# Altium project 4ADI_2DO.PrjPCB (part 2 of 6)
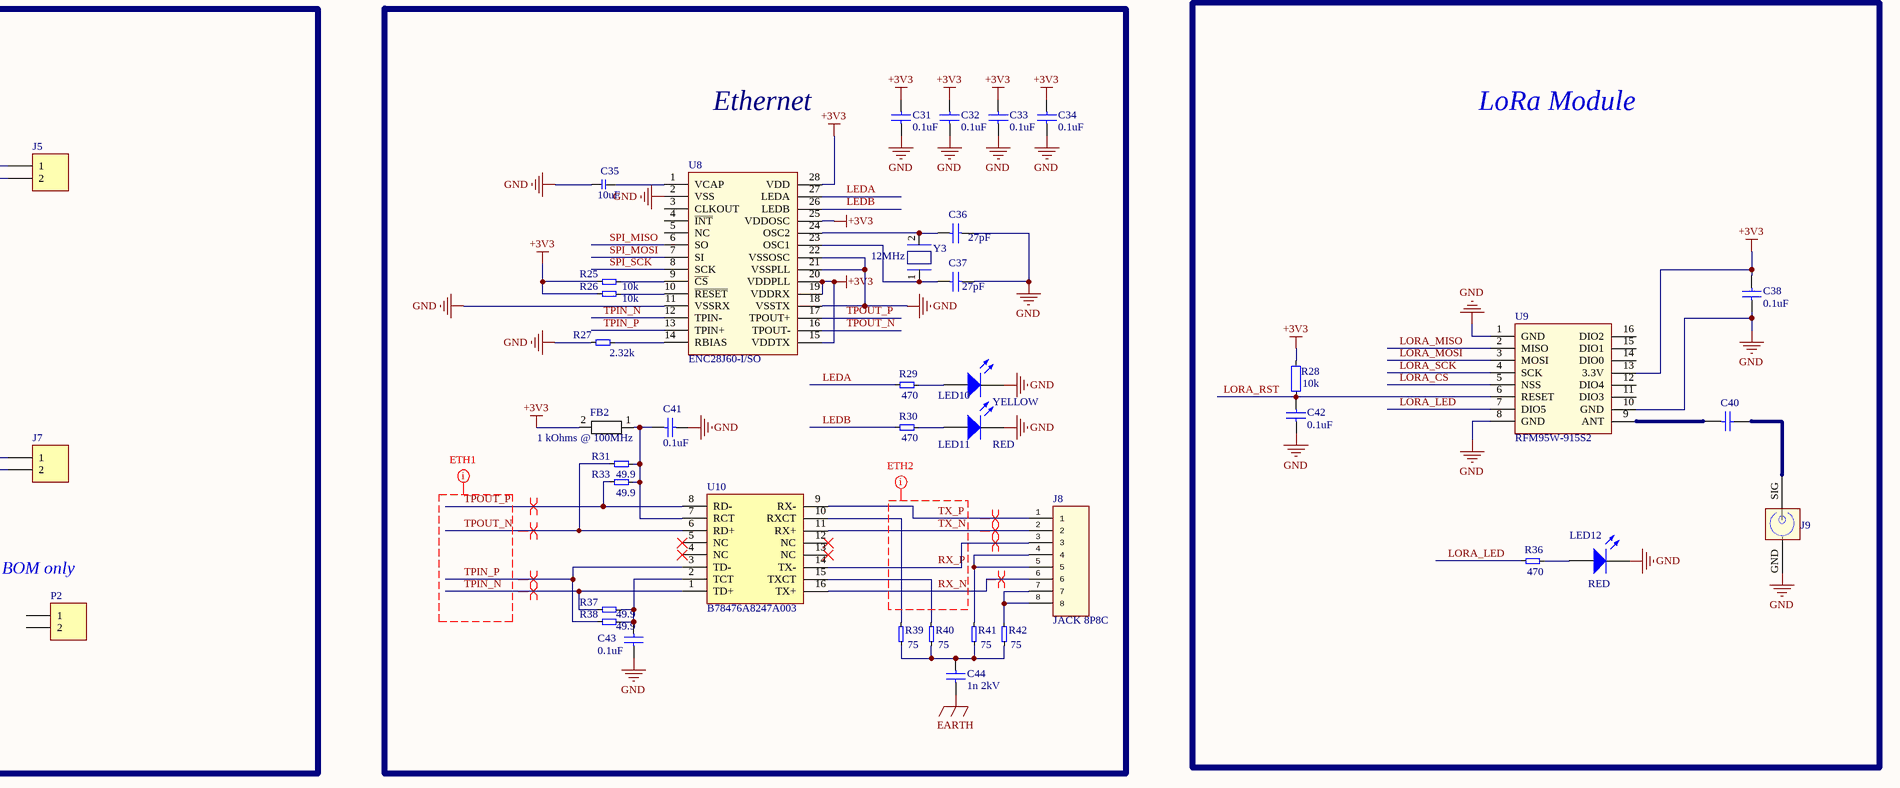
[diagram p8: main board.SchDoc, bottom right]

## Sheet main board.SchDoc (continued)
### Library data of the parts
BT1 = Battery: BATTERY LITHIUM 3V COIN 12.5MM; Manufacturer: Panasonic BSG; Capacity: 35mAh; Supplier 1: Digi-Key; Supplier Part Number 1: P279-ND; Manufacturer Part Number: CR-1220/FCN; Stock 1: 22607; Pricing 1: 1=1.28, 10=1.067, 50=0.9356, 100=0.8872, 250=0.82416, 500=0.78052, 1000=0.7369, 2500=0.68357 (USD); Mount: Through Hole; Contact Plating: Tin; Min Operating Temperature: -30°C; Max Operating Temperature: 60°C; Package Quantity: 1000; Output Voltage: 3V; Chemistry/Technology: Lithium; Voltage Rating: 3V; Packaging: Bulk; Termination: Through Hole; Orientation: Vertical; Diameter: 12mm; Height: 2mm; Lead Free: Lead Free; ComponentLink1URL: http://www.mouser.com/ds/2/315/AAA4000CE42-469979.pdf?src-supplier=Mouser; ComponentLink1Description: http://www.mouser.com/ds/2/315/AAA4000CE42-469979.pdf?src-supplier=Mouser; ComponentLink2URL: https://media.digikey.com/pdf/Data%20Sheets/Panasonic%20Inustrial/CR_Series.pdf?src-supplier=Digi-Key; ComponentLink2Description: https://media.digikey.com/pdf/Data%20Sheets/Panasonic%20Inustrial/CR_Series.pdf?src-supplier=Digi-Key
C1 C5 C9 C11 C13 C16 C19 C21 C22 C25-C34 C38 C41-C43 = Cap: CAP CER 0.1UF 50V X7R 0603; Manufacturer: Yageo; Manufacturer Part Number: CC0603KPX7R9BB104; Supplier 1: Digi-Key; Supplier Part Number 1: 311-3567-1-ND
C2 C14 C17 C18 C24 C35 C39 = CAP_0603: CAP CER 10UF 10V X5R 0603; Manufacturer: Murata; Manufacturer Part Number: GRM188R61A106KE69D; Tolerance: 10%; Supplier 1: Digi-Key; Supplier Part Number 1: 490-10474-1-ND; Stock 1: 6085579; Pricing 1: 1=0.21, 10=0.141, 100=0.0713, 500=0.04876, 1000=0.04313 (USD); Mount: Surface Mount; Case/Package: 0603; Case Code (Metric): 1608; Case Code (Imperial): 0603; Min Operating Temperature: -55°C; Max Operating Temperature: 85°C; Capacitance: 10uF; Packaging: Tape and Reel; Dielectric: X5R; Voltage Rating: 10V; Voltage: 10V; Voltage Rating (DC): 10V; Length: 1.6mm; Height: 0.8mm; Width: 0.031inch; Thickness: 0.037inch; Depth: 0.8mm; REACH SVHC: No SVHC; Lead Free: Lead Free
C3 C6 C36 C37 = Cap: CAP CER 27PF 50V C0G/NP0 0603; Manufacturer: Walsin Technologies; Manufacturer Part Number: 0603N270J500CT; Tolerance: 5%; Dielectric: C0G; Insulation Resistance: 10GR; Supplier 1: Digi-Key; Supplier Part Number 1: 1292-1511-1-ND; Stock 1: 158614; Pricing 1: 1=0.1, 10=0.033, 100=0.0149, 500=0.01062, 1000=0.00835 (USD); Case/Package: 0603; Case Code (Metric): 1608; Case Code (Imperial): 0603; Min Operating Temperature: -55°C; Max Operating Temperature: 125°C; Voltage Rating: 50V; Capacitance: 27pF; Packaging: Tape and Reel; Voltage Rating (DC): 50V; Length: 1.6mm; Depth: 0.8mm; Radiation Hardening: No; REACH SVHC: Unknown; Lead Free: Lead Free; ComponentLink1URL: https://www.verical.com/server-webapp/html/getDatasheet?partID=753102&src-supplier=Verical; ComponentLink1Description: https://www.verical.com/server-webapp/html/getDatasheet?partID=753102&src-supplier=Verical
C4 C15 = CAP_0805: CAP CER 22UF 10V X5R 0805; Manufacturer: Samsung; Manufacturer Part Number: CL21A226KPCLRNC; Tolerance: 10%; Supplier 1: Digi-Key; Supplier Part Number 1: 1276-6786-1-ND; Stock 1: 1160786; Pricing 1: 1=0.37, 10=0.255, 100=0.1443, 500=0.10186, 1000=0.08913 (USD); Mount: Surface Mount; Case/Package: 0805; Case Code (Metric): 2012; Case Code (Imperial): 0805; Min Operating Temperature: -55°C; Max Operating Temperature: 85°C; Packaging: Tape and Reel; Capacitance: 22uF; Dielectric: X5R; Voltage Rating: 10V; Length: 2mm; Width: 0.049inch; Thickness: 0.037inch; Depth: 1.25mm; Radiation Hardening: No; Lead Free: Lead Free; ComponentLink1URL: https://www.verical.com/server-webapp/html/getDatasheet?partID=781772&src-supplier=Verical; ComponentLink1Description: https://www.verical.com/server-webapp/html/getDatasheet?partID=781772&src-supplier=Verical
C7 C20 C23 = CAP_0603: CAP CER 2.2UF 10V X7R 0603; Manufacturer: Samsung; Manufacturer Part Number: CL10B225KP8NNNC; Material: Ceramic; Tolerance: 10%; Supplier 1: Digi-Key; Supplier Part Number 1: 1276-1134-1-ND; Stock 1: 529713; Pricing 1: 1=0.18, 10=0.128, 100=0.06, 500=0.0421, 1000=0.03485 (USD); Mount: Surface Mount; Case/Package: 0603; Case Code (Metric): 1608; Case Code (Imperial): 0603; Contact Plating: Tin; Min Operating Temperature: -55°C; Max Operating Temperature: 125°C; Package Quantity: 1; Packaging: Tape and Reel; Capacitance: 2.2uF; Voltage Rating: 10V; Dielectric: X7R; Length: 1.6mm; Height: 0.8mm; Width: 0.031inch; Thickness: 0.035inch; Depth: 0.8mm; Radiation Hardening: No; ComponentLink1URL: https://media.digikey.com/pdf/Data%20Sheets/Samsung%20PDFs/CL_Series_MLCC_ds.pdf?src-supplier=Digi-Key; ComponentLink1Description: https://media.digikey.com/pdf/Data%20Sheets/Samsung%20PDFs/CL_Series_MLCC_ds.pdf?src-supplier=Digi-Key; ComponentLink2URL: http://www1.futureelectronics.com/doc/SAMSUNG/CL10B225KP8NNNC.pdf?src-supplier=Future+Electronics; ComponentLink2Description: http://www1.futureelectronics.com/doc/SAMSUNG/CL10B225KP8NNNC.pdf?src-supplier=Future+Electronics; ComponentLink3URL: https://www.verical.com/server-webapp/html/getDatasheet?partID=359568&src-supplier=Verical; ComponentLink3Description: https://www.verical.com/server-webapp/html/getDatasheet?partID=359568&src-supplier=Verical; ComponentLink4URL: https://produktinfo.conrad.com/datenblaetter/450000-474999/457933-da-01-en-VS_KONDENSATOR_0603.pdf?src-supplier=Conrad; ComponentLink4Description: https://produktinfo.conrad.com/datenblaetter/450000-474999/457933-da-01-en-VS_KONDENSATOR_0603.pdf?src-supplier=Conrad
C8 C10 = Cap: CAP CER 15PF 50V C0G/NP0 0603; Manufacturer: Walsin Technologies; Manufacturer Part Number: 0603N150J500CT; Tolerance: 5%; Dielectric: C0G; Supplier 1: Digi-Key; Supplier Part Number 1: 1292-1487-1-ND; Stock 1: 223228; Pricing 1: 1=0.1, 10=0.033, 100=0.0149, 500=0.01062, 1000=0.00835 (USD); Case/Package: 0603; Case Code (Metric): 1608; Case Code (Imperial): 0603; Min Operating Temperature: -55°C; Max Operating Temperature: 125°C; Packaging: Tape and Reel; Capacitance: 15pF; Voltage Rating: 50V; Voltage Rating (DC): 50V; Length: 1.6mm; Depth: 0.8mm; REACH SVHC: Unknown
C12 = CAP_0402: Rating: 50V; Value: NF; Supplier 1: Digi-Key
C40 = CAP: CAP CER 10PF 50V NPO 0603; Manufacturer: Yageo; Manufacturer Part Number: AC0603JRNPO9BN100; ComponentLink1URL: https://www.verical.com/server-webapp/html/getDatasheet?partID=355281&src-supplier=Verical; ComponentLink1Description: https://www.verical.com/server-webapp/html/getDatasheet?partID=355281&src-supplier=Verical; ComponentLink2URL: http://www.samsungsem.com/kr/support/product-search/mlcc/CL05C100JB5NNNC.jsp?src-supplier=Digi-Key; ComponentLink2Description: http://www.samsungsem.com/kr/support/product-search/mlcc/CL05C100JB5NNNC.jsp?src-supplier=Digi-Key; ComponentLink3URL: http://www1.futureelectronics.com/doc/SAMSUNG/CL05C100JB5NNNC.pdf?src-supplier=Future+Electronics; ComponentLink3Description: http://www1.futureelectronics.com/doc/SAMSUNG/CL05C100JB5NNNC.pdf?src-supplier=Future+Electronics; ComponentLink4URL: https://produktinfo.conrad.com/datenblaetter/450000-474999/458733-da-01-en-VS_KONDENSATOR_0402.pdf?src-supplier=Conrad; ComponentLink4Description: https://produktinfo.conrad.com/datenblaetter/450000-474999/458733-da-01-en-VS_KONDENSATOR_0402.pdf?src-supplier=Conrad; Supplier 1: Digi-Key; Supplier Part Number 1: 311-3088-1-ND
C44 = Cap: CAP CER 1000PF 2KV X7R 1210; Manufacturer: Kyocera AVX; Manufacturer Part Number: 1210GC102MAT1A; Capacitance: 1nF; Tolerance: 20%; Dissipation Factor: 2.5%; ComponentLink1URL: http://www.farnell.com/datasheets/1818074.pdf?src-supplier=Element14; ComponentLink1Description: http://www.farnell.com/datasheets/1818074.pdf?src-supplier=Element14; ComponentLink2URL: http://catalogs.avx.com/SurfaceMount.pdf?src-supplier=Digi-Key; ComponentLink2Description: http://catalogs.avx.com/SurfaceMount.pdf?src-supplier=Digi-Key; ComponentLink3URL: http://www.farnell.com/datasheets/1679506.pdf?src-supplier=Element14; ComponentLink3Description: http://www.farnell.com/datasheets/1679506.pdf?src-supplier=Element14; Supplier 1: Digi-Key; Supplier Part Number 1: 478-5184-1-ND; Stock 1: 16002; Pricing 1: 1=1.03, 10=0.781, 100=0.5588, 500=0.43264, 1000=0.37254 (USD); Mount: Surface Mount; Case/Package: 1210; Number of Pins: 2; Case Code (Metric): 3225; Case Code (Imperial): 1210; Contact Plating: Tin,Matte; Min Operating Temperature: -55°C; Max Operating Temperature: 125°C; Package Quantity: 2000; Voltage Rating: 2kV; Packaging: Tape and Reel; Voltage Rating (DC): 2kV; Dielectric: X7R; Termination: SMD/SMT; Length: 3.2mm; Height: 1.7mm; Width: 0.098inch; Thickness: 0.067inch; Depth: 2.5mm; Radiation Hardening: No; REACH SVHC: No SVHC; Lead Free: Lead Free; ComponentLink4URL: http://datasheets.avx.com/AVX-HV_MLCC.pdf?src-supplier=Digi-Key; ComponentLink4Description: http://datasheets.avx.com/AVX-HV_MLCC.pdf?src-supplier=Digi-Key; ComponentLink5URL: http://www.avx.com/docs/Catalogs/aphvc.pdf?src-supplier=Future+Electronics; ComponentLink5Description: http://www.avx.com/docs/Catalogs/aphvc.pdf?src-supplier=Future+Electronics; ComponentLink6URL: http://www.mouser.com/ds/2/40/X7RDielectric-777024.pdf?src-supplier=Mouser; ComponentLink6Description: http://www.mouser.com/ds/2/40/X7RDielectric-777024.pdf?src-supplier=Mouser
D1-D3 D6-D8 = DF2B7AFS,L3M: BIDIRECTIONAL ESD DIODE VRWM=+/-; Manufacturer: Toshiba; Manufacturer Part Number: DF2B7AFU,H3F; Supplier 1: Digi-Key; Supplier Part Number 1: DF2B7AFUH3FCT-ND
D4 D9 D10 = DIODE_1N4148X-TP: DIODE GEN PURP 75V 150MA SOD523; Manufacturer: MCC; Max Surge Current: 2A; Recovery Time: 4ns; Forward Voltage: 1.25V; Forward Current: 300mA; Max Reverse Leakage Current: 1uA; Power Dissipation: 200mW; Max Repetitive Reverse Voltage (Vrrm): 100V; Element Configuration: Single; Polarity: Standard; Capacitance: 2pF; Supplier 1: Digi-Key; Supplier Part Number 1: 1N4148XTPMSCT-ND; Manufacturer Part Number: 1N4148X-TP; Stock 1: 2140400; Pricing 1: 1=0.14, 10=0.125, 100=0.0815, 500=0.03986, 1000=0.02718 (USD); Mount: Surface Mount; Number of Pins: 2; Min Operating Temperature: -65°C; Max Operating Temperature: 150°C; Package Quantity: 1; Packaging: Tape and Reel; Average Rectified Current: 150mA; Reverse Recovery Time: 4ns; Peak Non-Repetitive Surge Current: 2A; Voltage Rating (DC): 75V; Current Rating: 150mA; Output Current: 300mA; Max Reverse Voltage (DC): 75V; Radiation Hardening: No; Lead Free: Lead Free; ComponentLink1URL: http://www.mccsemi.com/up_pdf/1N4148X(SOD-523).PDF?src-supplier=Digi-Key; ComponentLink1Description: http://www.mccsemi.com/up_pdf/1N4148X(SOD-523).PDF?src-supplier=Digi-Key; ComponentLink2URL: http://www.mouser.com/ds/2/258/1N4148X(SOD-523)-349105.pdf?src-supplier=Mouser; ComponentLink2Description: http://www.mouser.com/ds/2/258/1N4148X(SOD-523)-349105.pdf?src-supplier=Mouser; ComponentLink3URL: http://www.mccsemi.com/up_pdf/1N4148X(SOD-523).PDF?src-supplier=Future+Electronics; ComponentLink3Description: http://www.mccsemi.com/up_pdf/1N4148X(SOD-523).PDF?src-supplier=Future+Electronics
D5 = PMEG2020EJF: DIODE SCHOTTKY 20V 2A SC90; Manufacturer: Nexperia; Supplier 1: Digi-Key; Supplier Part Number 1: 1727-7474-1-ND; Manufacturer Part Number: PMEG2020EJF; Stock 1: 34040; Pricing 1: 1=0.41, 10=0.336, 100=0.2287, 500=0.17156, 1000=0.12866 (USD)
FB1 FB2 = Ferrite bead: FERRITE BEAD 1 KOHM 0603 1LN; Manufacturer: Wurth Electronics; Manufacturer Part Number: 74279266; Tolerance: 25%; Impedance: 1kR; Current Rating: 200mA; DC Resistance (DCR): 600mR; Inductance: 1.8nH; Shielding: Unshielded; Supplier 1: Digi-Key; Supplier Part Number 1: 732-4484-1-ND; Stock 1: 104717; Pricing 1: 1=0.17, 50=0.168, 100=0.155, 500=0.148, 1000=0.141, 2000=0.134 (USD); Case/Package: SMD/SMT; Case Code (Metric): 1608; Case Code (Imperial): 0603; Core Material: Ferrite; Min Operating Temperature: -55°C; Max Operating Temperature: 125°C; Packaging: Tape and Reel; Max DC Current: 200mA; Termination: SMD/SMT; Test Frequency: 100MHz; Length: 1.6mm; Height: 0.8mm; Depth: 0.8mm; Width: 0.8mm; REACH SVHC: Unknown; Lead Free: Lead Free; ComponentLink1URL: http://docs-europe.electrocomponents.com/webdocs/1408/0900766b8140888f.pdf?src-supplier=Allied+Electronics; ComponentLink1Description: http://docs-europe.electrocomponents.com/webdocs/1408/0900766b8140888f.pdf?src-supplier=Allied+Electronics; ComponentLink2URL: http://documents.rs-components.com/techlib://itc_doclist_GB.htm?stockno=3674856&src-supplier=RSComponents; ComponentLink2Description: http://documents.rs-components.com/techlib://itc_doclist_GB.htm?stockno=3674856&src-supplier=RSComponents; ComponentLink3URL: https://katalog.we-online.de/pbs/datasheet/74279266.pdf?src-supplier=Digi-Key; ComponentLink3Description: https://katalog.we-online.de/pbs/datasheet/74279266.pdf?src-supplier=Digi-Key; ComponentLink4URL: http://www.farnell.com/datasheets/1920067.pdf?src-supplier=Element14; ComponentLink4Description: http://www.farnell.com/datasheets/1920067.pdf?src-supplier=Element14; ComponentLink5URL: http://www.mouser.com/ds/2/445/74279266-221135.pdf?src-supplier=Mouser; ComponentLink5Description: http://www.mouser.com/ds/2/445/74279266-221135.pdf?src-supplier=Mouser; ComponentLink6URL: http://www.produktinfo.conrad.com/datenblaetter/1000000-1099999/001087059-da-01-ml-WE_CBF_SMD_FERRIT_74279266_de_en.pdf?src-supplier=Conrad; ComponentLink6Description: http://www.produktinfo.conrad.com/datenblaetter/1000000-1099999/001087059-da-01-ml-WE_CBF_SMD_FERRIT_74279266_de_en.pdf?src-supplier=Conrad
J1 J3 = 10118194-0001LF: CONN RCPT USB2.0 MICRO B SMD R/A; Manufacturer: Amphenol FCI; Gender: Receptacle; Current Rating: 1.8A; Connector Type: USB,Receptacle; Number of Contacts: 5; Insulation Resistance: 1GR; Number of Ports: 1; Max Voltage Rating (AC): 100V; Pitch: 0.65mm; Supplier 1: Digi-Key; Supplier Part Number 1: 609-4618-1-ND; Manufacturer Part Number: 10118194-0001LF; Stock 1: 145984; Pricing 1: 1=0.42, 10=0.393, 25=0.3536, 50=0.3144, 100=0.3013, 250=0.27512, 500=0.26202 (USD); Mount: Surface Mount,Horizontal; Contact Material: Copper Alloy; Contact Plating: Gold; Number of Terminals: 5; Housing Material: Polymer; Color: Black; Min Operating Temperature: -55°C; Max Operating Temperature: 85°C; Package Quantity: 9600; Packaging: Tape and Reel; Termination: Solder; Orientation: Right Angle; Features: Shielded; Length: 8.05mm; Depth: 5mm; Radiation Hardening: No; Lead Free: Lead Free; Flammability Rating: UL94 V-0; ComponentLink1URL: http://www.amphenol-icc.com/media/wysiwyg/files/drawing/10118194.pdf?src-supplier=Digi-Key; ComponentLink1Description: http://www.amphenol-icc.com/media/wysiwyg/files/drawing/10118194.pdf?src-supplier=Digi-Key; ComponentLink2URL: https://cdn.amphenol-icc.com/media/wysiwyg/files/drawing/10118194.pdf?src-supplier=Mouser; ComponentLink2Description: https://cdn.amphenol-icc.com/media/wysiwyg/files/drawing/10118194.pdf?src-supplier=Mouser; ComponentLink3URL: https://cdn.amphenol-icc.com/media/wysiwyg/files/drawing/10118194.pdf?src-supplier=Avnet; ComponentLink3Description: https://cdn.amphenol-icc.com/media/wysiwyg/files/drawing/10118194.pdf?src-supplier=Avnet; ComponentLink4URL: https://cdn.amphenol-icc.com/media/wysiwyg/files/drawing/10118194.pdf?src-supplier=Verical; ComponentLink4Description: https://cdn.amphenol-icc.com/media/wysiwyg/files/drawing/10118194.pdf?src-supplier=Verical
J2 = FTSH-105-01-F-DV-K: CONN HEADER SMD 10POS 1.27MM; Manufacturer: Samtec; Manufacturer Part Number: FTSH-105-01-F-DV-K-TR; Max Current Rating: 1.75A; Number of Contacts: 10; Supplier 1: Digi-Key; Supplier Part Number 1: SAM13160CT-ND; Stock 1: 1946; Pricing 1: 1=3.36, 10=3.221, 100=2.684 (USD); Contact Plating: Gold; Contact Material: Bronze; Housing Color: Black; Housing Material: Polymer; Min Operating Temperature: -55°C; Max Operating Temperature: 125°C; Number of Rows: 2; Packaging: Tape and Reel; Termination: Solder; Orientation: Straight; Length: 6.35mm; Pitch: 1.27mm; Depth: 3.43mm; Radiation Hardening: No; Lead Free: Lead Free; ComponentLink1URL: http://www.samtec.com/documents/webfiles/pdf/ftsh_mt.pdf?src-supplier=Avnet+Europe; ComponentLink1Description: http://www.samtec.com/documents/webfiles/pdf/ftsh_mt.pdf?src-supplier=Avnet+Europe; ComponentLink2URL: http://www.samtec.com/documents/webfiles/pdf/ftsh_mt.pdf?src-supplier=Avnet; ComponentLink2Description: http://www.samtec.com/documents/webfiles/pdf/ftsh_mt.pdf?src-supplier=Avnet; ComponentLink3URL: https://www.verical.com/server-webapp/html/getDatasheet?partID=314617&src-supplier=Verical; ComponentLink3Description: https://www.verical.com/server-webapp/html/getDatasheet?partID=314617&src-supplier=Verical
J4 J6 = Header 4: Header, 4-Pin; Manufacturer: Amphenol FCI; Manufacturer Part Number: 68001-404HLF; Current Rating: 3A; Voltage Rating: 1.5kV; Number of Positions: 4; Insulation Resistance: 5GR; Gender: Male; Connector Type: Male Pin; Pitch: 2.54mm; Mating Post Length: 5.84mm; LatestRevisionDate: 17-Jul-2002; LatestRevisionNote: Re-released for DXP Platform.; Publisher: Altium Limited; Supplier 1: Digi-Key; Supplier Part Number 1: 609-3404-ND; Stock 1: 0; Mount: Through Hole; Contact Plating: Tin; Contact Material: Bronze; Color: Black; Housing Color: Black; Housing Material: Thermoplastic; Min Operating Temperature: -65°C; Max Operating Temperature: 125°C; Number of Rows: 1; Contact Gender: Male; Packaging: Bulk; Package Quantity: 100; Termination: Solder; Number of Contacts: 4; Max Voltage Rating (AC): 1.5kV; Orientation: Straight; Length: 10.16mm; Termination Post Length: 3.05mm; Contact Mating Length: 0.23inch; Depth: 2.41mm; Radiation Hardening: No; Lead Free: Lead Free; Flammability Rating: UL94 V-0; ComponentLink1URL: http://www.mouser.com/ds/2/154/68000-50221.pdf; ComponentLink1Description: http://www.mouser.com/ds/2/154/68000-50221.pdf; ComponentLink2URL: http://portal.fciconnect.com/Comergent/fci/drawing/68000.pdf; ComponentLink2Description: http://portal.fciconnect.com/Comergent/fci/drawing/68000.pdf; ComponentLink3URL: https://cdn.amphenol-icc.com/media/wysiwyg/files/drawing/68000.pdf; ComponentLink3Description: https://cdn.amphenol-icc.com/media/wysiwyg/files/drawing/68000.pdf
J5 J7 = Header 2: TERM BLK 2P SIDE ENT 5.08MM PCB; Manufacturer: Sauro; Manufacturer Part Number: CIM025P5; Supplier 1: Digi-Key
J8 = RJ45 SMD CONNECTOR: CONN MOD JACK 8P8C R/A SHIELDED; Manufacturer: Molex; Manufacturer Part Number: 95622-3981; Connector Type: RJ45; Number of Ports: 1; Number of Positions Loaded: 8; Current Rating: 1.5A; Gender: Female; Voltage Rating: 125V; Pitch: 2.54mm; ComponentLink1URL: https://www.verical.com/server-webapp/html/getDatasheet?partID=757801&src-supplier=Verical; ComponentLink1Description: https://www.verical.com/server-webapp/html/getDatasheet?partID=757801&src-supplier=Verical; ComponentLink2URL: http://www.molex.com/webdocs/datasheets/pdf/en-us/0956223981_MODULAR_JACKS_PLUG.pdf?src-supplier=Avnet; ComponentLink2Description: http://www.molex.com/webdocs/datasheets/pdf/en-us/0956223981_MODULAR_JACKS_PLUG.pdf?src-supplier=Avnet; ComponentLink3URL: http://www.onlinecomponents.com/productFiles/mf-MOL/28460956223981_modular_jacks_plug.pdf?src-supplier=Onlinecomponents.com; ComponentLink3Description: http://www.onlinecomponents.com/productFiles/mf-MOL/28460956223981_modular_jacks_plug.pdf?src-supplier=Onlinecomponents.com; Supplier 1: Digi-Key; Supplier Part Number 1: WM3653-ND; Stock 1: 7934; Pricing 1: 1=1.74, 10=1.575, 25=1.4784, 50=1.4142, 100=1.35, 250=1.2214, 500=1.12498, 1000=0.96428, 2500=0.89999 (USD); Mount: Through Hole; Contact Plating: Gold; Contact Material: Brass,Copper; Housing Color: Black; Housing Material: Polymer; Color: Black; Min Operating Temperature: -40°C; Max Operating Temperature: 80°C; Package Quantity: 1848; Shielding: Shielded; Packaging: Rail/Tube; Termination: Through Hole; Orientation: Right Angle; Number of Positions: 8; Number of Contacts: 8; Length: 15.6mm; Depth: 18.8mm; Radiation Hardening: No; REACH SVHC: Unknown; Halogen Free: Low Halogen; Flammability Rating: UL94 V-0
J9 = U.FL-R-SMT(10): CONN U.FL RCPT STR 50 OHM SM; Manufacturer: Hirose; Body Material: Bronze; Plating: Silver; Dielectric Material: Polymer; Impedance: 50R; Connector Type: Coaxial,Receptacle,Male Pin; Max Frequency: 6GHz; Supplier 1: Digi-Key; Supplier Part Number 1: H9161CT-ND; Manufacturer Part Number: U.FL-R-SMT(10); Stock 1: 217446; Pricing 1: 1=1.31, 10=1.15, 25=1.0824, 50=1.0374, 100=0.9922, 250=0.902, 500=0.8118, 1000=0.7216 (USD); Mount: Surface Mount; Case/Package: SMD/SMT; Contact Material: Brass; Contact Plating: Gold; Body Plating: Silver; Housing Color: Beige; Min Operating Temperature: -40°C; Max Operating Temperature: 90°C; Package Quantity: 1; Fastening Type: Snap; Packaging: Tape and Reel; Termination: Solder; Frequency: 6GHz; Orientation: Vertical; Length: 3mm; Depth: 3.1mm; Radiation Hardening: No; Lead Free: Lead Free; ComponentLink1URL: https://www.verical.com/server-webapp/html/getDatasheet?partID=449682&src-supplier=Verical; ComponentLink1Description: https://www.verical.com/server-webapp/html/getDatasheet?partID=449682&src-supplier=Verical
K1 K2 = 5V RELAY: RELAY GENERAL PURPOSE SPDT 8A 5V; Manufacturer: Omron; Manufacturer Part Number: G6RN-1-DC5; Voltage Rating (AC): 250V; Voltage Rating (DC): 30V; Coil Current: 44mA; Coil Resistance: 114R; Operate Time: 15ms; Power Consumption: 220mW; Coil Type: Non-Latching; Release Time: 5ms; Approvals: UL,CSA,VDE,IEC; Supplier 1: Digi-Key; Supplier Part Number 1: Z987-ND; Stock 1: 11252; Pricing 1: 1=3.2, 10=3.003, 25=2.6696, 50=2.5362, 100=2.4028, 250=2.1358, 500=2.00232, 1000=1.86883, 5000=1.80209 (USD); Mount: Through Hole,PCB; Number of Pins: 5; Weight: 9g; Contact Material: Silver,Gold; Min Operating Temperature: -40°C; Max Operating Temperature: 85°C; Contact Current Rating: 8A; Max Current Rating: 8A; Max Voltage Rating (AC): 250V; Max Voltage Rating (DC): 30V; Packaging: Bulk; Throw Configuration: SPDT; Termination: PC Pin; Coil Voltage (DC): 5V; Package Quantity: 400; Relay Type: General Purpose; Coil Power: 220mW; Current Rating: 8A; Length: 28.5mm; Height: 15.3mm; Depth: 10mm; Radiation Hardening: No; Lead Free: Lead Free; ComponentLink1URL: https://www.verical.com/server-webapp/html/getDatasheet?partID=761854&src-supplier=Verical; ComponentLink1Description: https://www.verical.com/server-webapp/html/getDatasheet?partID=761854&src-supplier=Verical
LED1-LED4 LED6 LED8 LED9 LED11 LED12 = LED_0402: LED RED CLEAR 2SMD; Manufacturer: Everlight Electronics Co Ltd; Manufacturer Part Number: 19-217/R6C-AL1M2VY/3T; Supplier 1: Digi-Key; Supplier Part Number 1: 1080-1585-1-ND
LED5 LED7 LED10 = LED_0402: LED YELLOW CLEAR CHIP SMD; Manufacturer: Lite-On Inc.; Manufacturer Part Number: LTST-C193KSKT-5A; Supplier 1: Digi-Key; Supplier Part Number 1: 160-1831-1-ND
P1 P2 = Header 2: Plug; Manufacturer: Sauro; Manufacturer Part Number: CIF02005; Supplier 1: Digi-Key
Q1-Q3 = MMBT2222LT1G: TRANS NPN 30V 0.6A SOT23; Manufacturer: ON Semiconductor; hFE Min: 100; Frequency: 250MHz; Max Power Dissipation: 225mW; Number of Elements: 1; Max Collector Current: 600mA; Collector Base Voltage (VCBO): 60V; Emitter Base Voltage (VEBO): 5V; Collector Emitter Saturation Voltage: 1.6V; Power Dissipation: 300mW; Element Configuration: Single; Supplier 1: Digi-Key; Supplier Part Number 1: MMBT2222LT1GOSCT-ND; Manufacturer Part Number: MMBT2222LT1G; Stock 1: 167907; Pricing 1: 1=0.14, 10=0.129, 100=0.0703, 500=0.04328, 1000=0.02952 (USD); Case/Package: SOT-23-3; Number of Pins: 3; Weight: 0.01lb; Contact Plating: Tin,Matte; Min Operating Temperature: -55°C; Max Operating Temperature: 150°C; Collector Emitter Voltage (VCEO): 30V; Package Quantity: 1; Packaging: Tape and Reel; Transition Frequency: 250MHz; Collector Emitter Breakdown Voltage: 30V; Max Breakdown Voltage: 30V; Polarity: NPN; Max Frequency: 250MHz; Termination: SMD/SMT; Gain Bandwidth Product: 250MHz; Voltage Rating (DC): 30V; Current Rating: 600mA; Length: 3.04mm; Height: 1.11mm; Width: 2.64mm; Radiation Hardening: No; REACH SVHC: No SVHC; Lead Free: Lead Free; ComponentLink1URL: http://www.onsemi.com/pub/Collateral/MMBT2222LT1-D.PDF?src-supplier=Digi-Key; ComponentLink1Description: http://www.onsemi.com/pub/Collateral/MMBT2222LT1-D.PDF?src-supplier=Digi-Key; ComponentLink2URL: https://www.verical.com/server-webapp/html/getDatasheet?partID=91924&src-supplier=Verical; ComponentLink2Description: https://www.verical.com/server-webapp/html/getDatasheet?partID=91924&src-supplier=Verical; ComponentLink3URL: http://www.onsemi.com/pub/Collateral/MMBT2222LT1-D.PDF?src-supplier=Element14; ComponentLink3Description: http://www.onsemi.com/pub/Collateral/MMBT2222LT1-D.PDF?src-supplier=Element14; ComponentLink4URL: http://www.onsemi.com/pub/Collateral/MMBT2222LT1-D.PDF?src-supplier=Avnet+Europe; ComponentLink4Description: http://www.onsemi.com/pub/Collateral/MMBT2222LT1-D.PDF?src-supplier=Avnet+Europe; ComponentLink5URL: http://www.farnell.com/datasheets/1644026.pdf?src-supplier=Element14; ComponentLink5Description: http://www.farnell.com/datasheets/1644026.pdf?src-supplier=Element14; ComponentLink6URL: http://www.mouser.com/ds/2/308/MMBT2222LT1-D-80103.pdf?src-supplier=Mouser; ComponentLink6Description: http://www.mouser.com/ds/2/308/MMBT2222LT1-D-80103.pdf?src-supplier=Mouser; ComponentLink7URL: http://www.onsemi.com/pub_link/Collateral/MMBT2222LT1-D.PDF?src-supplier=Future+Electronics; ComponentLink7Description: http://www.onsemi.com/pub_link/Collateral/MMBT2222LT1-D.PDF?src-supplier=Future+Electronics; ComponentLink8URL: http://www.onsemi.com/pub/Collateral/MMBT2222LT1-D.PDF?src-supplier=Avnet; ComponentLink8Description: http://www.onsemi.com/pub/Collateral/MMBT2222LT1-D.PDF?src-supplier=Avnet
Q4 Q5 = 2N3904: TRANS NPN 40V 0.2A TO-92; Manufacturer: ON Semiconductor / Fairchild; Max Power Dissipation: 625mW; Number of Elements: 1; hFE Min: 100; Frequency: 300MHz; Max Collector Current: 200mA; Collector Base Voltage (VCBO): 60V; Emitter Base Voltage (VEBO): 6V; Collector Emitter Saturation Voltage: 300mV; Element Configuration: Single; Supplier 1: Digi-Key; Supplier Part Number 1: 2N3904FS-ND; Manufacturer Part Number: 2N3904BU; Stock 1: 110507; Pricing 1: 1=0.21, 10=0.173, 100=0.0916, 500=0.06024, 1000=0.04097 (USD); Mount: Through Hole; Case/Package: TO-92; Number of Pins: 3; Weight: 0.179g; Min Operating Temperature: -55°C; Max Operating Temperature: 150°C; Package Quantity: 1000; Collector Emitter Voltage (VCEO): 40V; Packaging: Bulk; Transition Frequency: 300MHz; Polarity: NPN; Collector Emitter Breakdown Voltage: 40V; Power Dissipation: 625mW; Max Frequency: 300MHz; Gain Bandwidth Product: 300MHz; Voltage Rating (DC): 60V; Current Rating: 200mA; Length: 5.2mm; Height: 5.33mm; Width: 4.19mm; Radiation Hardening: No; REACH SVHC: No SVHC; Lead Free: Lead Free; ComponentLink1URL: http://www.farnell.com/datasheets/2110847.pdf?src-supplier=Farnell; ComponentLink1Description: http://www.farnell.com/datasheets/2110847.pdf?src-supplier=Farnell; ComponentLink2URL: https://www.fairchildsemi.com/datasheets/MM/MMBT3904.pdf?src-supplier=Digi-Key; ComponentLink2Description: https://www.fairchildsemi.com/datasheets/MM/MMBT3904.pdf?src-supplier=Digi-Key; ComponentLink3URL: http://www.fairchildsemi.com/ds/MM/MMBT3904.pdf?src-supplier=Avnet+Europe; ComponentLink3Description: http://www.fairchildsemi.com/ds/MM/MMBT3904.pdf?src-supplier=Avnet+Europe; ComponentLink4URL: http://www.jameco.com/Jameco/Products/ProdDS/783421.pdf?src-supplier=Jameco; ComponentLink4Description: http://www.jameco.com/Jameco/Products/ProdDS/783421.pdf?src-supplier=Jameco; ComponentLink5URL: https://www.verical.com/server-webapp/html/getDatasheet?partID=185752&src-supplier=Verical; ComponentLink5Description: https://www.verical.com/server-webapp/html/getDatasheet?partID=185752&src-supplier=Verical
R1 R2 R5-R8 R12 R29 R30 R36 = R_0402: RES SMD 470 OHM 1% 1/10W 0603; Manufacturer: Yageo; Manufacturer Part Number: RC0603FR-07470RL; Supplier 1: Digi-Key; Supplier Part Number 1: 311-470HRCT-ND
R3 = Res_0603: RES SMD 4.7K OHM 1% 1/10W 0603; Manufacturer: Yageo Phycomp; Manufacturer Part Number: RC0603FR-074K7L; Temperature Coefficient: 100ppm/°C; Voltage Rating (DC): 50V; Resistance: 4.7kR; Power Rating: 100mW; Supplier 1: Digi-Key; Supplier Part Number 1: 311-4.70KHRCT-ND; Stock 1: 19144100; Pricing 1: 1=0.1, 10=0.024, 100=0.0097, 1000=0.00437, 2500=0.00379 (USD); Mount: Surface Mount; Case/Package: 0603; Number of Pins: 2; Min Operating Temperature: -55°C; Max Operating Temperature: 155°C; Tolerance: 1%; Packaging: Cut Tape; Length: 1.6mm; Height: 0.45mm; Width: 800um; Depth: 0.8mm; REACH SVHC: No SVHC; Lead Free: Lead Free
R4 R9 R13 R14 R16 R17 = R_0402: RES SMD 0 OHM JUMPER 1/10W 0603; Manufacturer: Yageo; Manufacturer Part Number: RC0603JR-070RL; ComponentLink1URL: http://www.yageo.com/documents/recent/PYu-RC_Group_51_RoHS_L_10.pdf?src-supplier=Digi-Key; ComponentLink1Description: http://www.yageo.com/documents/recent/PYu-RC_Group_51_RoHS_L_10.pdf?src-supplier=Digi-Key; ComponentLink2URL: http://www.yageo.com/documents/recent/PYu-RC0402_51_RoHS_L_6.pdf?src-supplier=Avnet+Europe; ComponentLink2Description: http://www.yageo.com/documents/recent/PYu-RC0402_51_RoHS_L_6.pdf?src-supplier=Avnet+Europe; ComponentLink3URL: http://www.farnell.com/datasheets/1018594.pdf?src-supplier=Element14; ComponentLink3Description: http://www.farnell.com/datasheets/1018594.pdf?src-supplier=Element14; ComponentLink4URL: https://www.verical.com/server-webapp/html/getDatasheet?partID=326379&src-supplier=Verical; ComponentLink4Description: https://www.verical.com/server-webapp/html/getDatasheet?partID=326379&src-supplier=Verical; ComponentLink5URL: http://www.farnell.com/datasheets/2167052.pdf?src-supplier=Element14; ComponentLink5Description: http://www.farnell.com/datasheets/2167052.pdf?src-supplier=Element14; Supplier 1: Digi-Key; Supplier Part Number 1: 311-0.0GRCT-ND
R10 R18 = R_0402: RES SMD 100K OHM 1% 1/10W 0603; Manufacturer: Yageo; Manufacturer Part Number: RC0603FR-07100KL; Resistance: 100kR; Temperature Coefficient: 100ppm/°C; Voltage Rating (DC): 50V; Power Rating: 100mW; Working Voltage: 75V; ComponentLink1URL: http://www.yageo.com/documents/recent/PYu-RC_Group_51_RoHS_L_10.pdf?src-supplier=Digi-Key; ComponentLink1Description: http://www.yageo.com/documents/recent/PYu-RC_Group_51_RoHS_L_10.pdf?src-supplier=Digi-Key; ComponentLink2URL: http://www.farnell.com/datasheets/1018594.pdf?src-supplier=Element14; ComponentLink2Description: http://www.farnell.com/datasheets/1018594.pdf?src-supplier=Element14; ComponentLink3URL: http://www.yageo.com/documents/recent/PYu-RC_Group_51_RoHS_L_9.pdf?src-supplier=Verical; ComponentLink3Description: http://www.yageo.com/documents/recent/PYu-RC_Group_51_RoHS_L_9.pdf?src-supplier=Verical; ComponentLink4URL: http://www.yageo.com/documents/recent/PYu-RC_Group_51_RoHS_L_8.pdf?src-supplier=Future+Electronics; ComponentLink4Description: http://www.yageo.com/documents/recent/PYu-RC_Group_51_RoHS_L_8.pdf?src-supplier=Future+Electronics; ComponentLink5URL: http://www.yageo.com/documents/recent/PYu-RC_Group_51_RoHS_L_9.pdf?src-supplier=Mouser; ComponentLink5Description: http://www.yageo.com/documents/recent/PYu-RC_Group_51_RoHS_L_9.pdf?src-supplier=Mouser; ComponentLink6URL: http://documents.rs-components.com/techlib://itc_doclist_GB.htm?stockno=6185797&src-supplier=RSComponents; ComponentLink6Description: http://documents.rs-components.com/techlib://itc_doclist_GB.htm?stockno=6185797&src-supplier=RSComponents; ComponentLink7URL: http://www.farnell.com/datasheets/2167052.pdf?src-supplier=Element14; ComponentLink7Description: http://www.farnell.com/datasheets/2167052.pdf?src-supplier=Element14; ComponentLink8URL: http://www.farnell.com/datasheets/1868787.pdf?src-supplier=Element14; ComponentLink8Description: http://www.farnell.com/datasheets/1868787.pdf?src-supplier=Element14; ComponentLink9URL: http://documents.rs-components.com/techlib://itc_doclist_GB.htm?stockno=5048940&src-supplier=RSComponents; ComponentLink9Description: http://documents.rs-components.com/techlib://itc_doclist_GB.htm?stockno=5048940&src-supplier=RSComponents; ComponentLink10URL: http://www.farnell.com/datasheets/443971.pdf?src-supplier=Element14; ComponentLink10Description: http://www.farnell.com/datasheets/443971.pdf?src-supplier=Element14; Supplier 1: Digi-Key; Supplier Part Number 1: 311-100KHRCT-ND; Stock 1: 44881179; Pricing 1: 1=0.1, 10=0.023, 100=0.0094, 1000=0.00421, 2500=0.00366 (USD); Case/Package: 0603; Number of Pins: 2; Case Code (Imperial): 0603; Case Code (Metric): 1608; Min Operating Temperature: -55°C; Max Operating Temperature: 155°C; Tolerance: 1%; Packaging: Tape and Reel; Composition: Thick Film; Military Standard: Not; Voltage Rating: 50V; Termination: SMD/SMT; Number of Terminations: 2; Length: 1.6mm; Height: 0.45mm; Width: 0.8mm; Depth: 0.8mm; REACH SVHC: No SVHC; Lead Free: Lead Free
R11 = R_0402: Tolerance: 1%; Value: NF; Supplier 1: Digi-Key
R15 R19-R21 R24-R26 R35 = R_0402: RES SMD 10K OHM 1% 1/10W 0603; Manufacturer: Yageo; Manufacturer Part Number: RC0603FR-0710KL; ComponentLink1URL: http://www.farnell.com/datasheets/2167052.pdf?src-supplier=Element14; ComponentLink1Description: http://www.farnell.com/datasheets/2167052.pdf?src-supplier=Element14; ComponentLink2URL: http://www.farnell.com/datasheets/1784430.pdf?src-supplier=Element14; ComponentLink2Description: http://www.farnell.com/datasheets/1784430.pdf?src-supplier=Element14; ComponentLink3URL: http://documents.rs-components.com/techlib://itc_doclist_GB.htm?stockno=6185832&src-supplier=RSComponents; ComponentLink3Description: http://documents.rs-components.com/techlib://itc_doclist_GB.htm?stockno=6185832&src-supplier=RSComponents; ComponentLink4URL: http://www.yageo.com/documents/recent/PYu-RC0402_51_RoHS_L_6_r.pdf?src-supplier=Future+Electronics; ComponentLink4Description: http://www.yageo.com/documents/recent/PYu-RC0402_51_RoHS_L_6_r.pdf?src-supplier=Future+Electronics; ComponentLink5URL: http://www.farnell.com/datasheets/1686128.pdf?src-supplier=Element14; ComponentLink5Description: http://www.farnell.com/datasheets/1686128.pdf?src-supplier=Element14; ComponentLink6URL: http://www.farnell.com/datasheets/1018594.pdf?src-supplier=Element14; ComponentLink6Description: http://www.farnell.com/datasheets/1018594.pdf?src-supplier=Element14; ComponentLink7URL: http://www.yageo.com/documents/recent/PYu-RC_Group_51_RoHS_L_9.pdf?src-supplier=Mouser; ComponentLink7Description: http://www.yageo.com/documents/recent/PYu-RC_Group_51_RoHS_L_9.pdf?src-supplier=Mouser; Supplier 1: Digi-Key; Supplier Part Number 1: 311-10.0KHRCT-ND
R22 R23 R32 R34 = R_0402: RES SMD 1K OHM 1% 1/10W 0603; Manufacturer: Yageo; Manufacturer Part Number: RC0603FR-071KL; ComponentLink1URL: http://documents.rs-components.com/techlib://itc_doclist_GB.htm?stockno=6186122&src-supplier=RSComponents; ComponentLink1Description: http://documents.rs-components.com/techlib://itc_doclist_GB.htm?stockno=6186122&src-supplier=RSComponents; ComponentLink2URL: http://www.mouser.com/ds/2/447/PYu-RC0402_51_RoHS_L_6_r-8721.pdf?src-supplier=Mouser; ComponentLink2Description: http://www.mouser.com/ds/2/447/PYu-RC0402_51_RoHS_L_6_r-8721.pdf?src-supplier=Mouser; ComponentLink3URL: http://www.yageo.com/documents/recent/PYu-RC0402_51_RoHS_L_6_r.pdf?src-supplier=Future+Electronics; ComponentLink3Description: http://www.yageo.com/documents/recent/PYu-RC0402_51_RoHS_L_6_r.pdf?src-supplier=Future+Electronics; ComponentLink4URL: http://www.farnell.com/datasheets/1018594.pdf?src-supplier=Element14; ComponentLink4Description: http://www.farnell.com/datasheets/1018594.pdf?src-supplier=Element14; ComponentLink5URL: http://www.farnell.com/datasheets/2167052.pdf?src-supplier=Element14; ComponentLink5Description: http://www.farnell.com/datasheets/2167052.pdf?src-supplier=Element14; Supplier 1: Digi-Key; Supplier Part Number 1: 311-1.00KHRCT-ND
R27 = R_0402: RES SMD 2.32K OHM 1% 1/10W 0603; Manufacturer: Yageo; Manufacturer Part Number: RC0603FR-072K32L; Resistance: 2.32kR; Power Rating: 100mW; Voltage Rating: 50V; Temperature Coefficient: 100ppm/°C; ComponentLink1URL: http://www.yageo.com/documents/recent/PYu-RC0402_51_RoHS_L_6.pdf?src-supplier=Avnet; ComponentLink1Description: http://www.yageo.com/documents/recent/PYu-RC0402_51_RoHS_L_6.pdf?src-supplier=Avnet; ComponentLink2URL: http://www.mouser.com/ds/2/447/PYu-RC0402_51_RoHS_L_6_r-8721.pdf?src-supplier=Mouser; ComponentLink2Description: http://www.mouser.com/ds/2/447/PYu-RC0402_51_RoHS_L_6_r-8721.pdf?src-supplier=Mouser; ComponentLink3URL: http://www.yageo.com/documents/recent/PYu-RC0402_51_RoHS_L_6.pdf?src-supplier=Avnet+Europe; ComponentLink3Description: http://www.yageo.com/documents/recent/PYu-RC0402_51_RoHS_L_6.pdf?src-supplier=Avnet+Europe; Supplier 1: Digi-Key; Supplier Part Number 1: 311-2.32KHRCT-ND; Stock 1: 582075; Pricing 1: 1=0.1, 10=0.023, 100=0.0094, 1000=0.00421, 2500=0.00366 (USD); Case/Package: 0603; Case Code (Metric): 1608; Case Code (Imperial): 0603; Min Operating Temperature: -55°C; Max Operating Temperature: 155°C; Package Quantity: 1; Tolerance: 1%; Packaging: Tape and Reel; Composition: Thick Film; Number of Terminations: 2; Termination: SMD/SMT; Military Standard: Not; Max Power Dissipation: 100mW; Voltage Rating (DC): 50V; Features: Moisture Resistant; Length: 1.6mm; Height: 0.022inch; Width: 0.031inch; Depth: 0.8mm; Lead Free: Lead Free; ComponentLink4URL: http://www.yageo.com/documents/recent/PYu-RC_Group_51_RoHS_L_10.pdf?src-supplier=Digi-Key; ComponentLink4Description: http://www.yageo.com/documents/recent/PYu-RC_Group_51_RoHS_L_10.pdf?src-supplier=Digi-Key; ComponentLink5URL: http://www.yageo.com/documents/recent/PYu-RC_Group_51_RoHS_L_9.pdf?src-supplier=Digi-Key; ComponentLink5Description: http://www.yageo.com/documents/recent/PYu-RC_Group_51_RoHS_L_9.pdf?src-supplier=Digi-Key; ComponentLink6URL: http://www.mouser.com/catalog/specsheets/RC0603.pdf?src-supplier=Mouser; ComponentLink6Description: http://www.mouser.com/catalog/specsheets/RC0603.pdf?src-supplier=Mouser
R28 = Res_0603: RES SMD 10K OHM 1% 1/10W 0603; Manufacturer: Yageo; Manufacturer Part Number: RC0603FR-0710KL; Resistance: 10kR; Temperature Coefficient: 100ppm/°C; Voltage Rating (DC): 50V; Power Rating: 100mW; Supplier 1: Digi-Key; Supplier Part Number 1: 311-10.0KHRCT-ND; Stock 1: 97048265; Pricing 1: 1=0.1, 10=0.024, 100=0.0097, 1000=0.00437, 2500=0.00379 (USD); Mount: Surface Mount; Case/Package: 0603; Number of Pins: 2; Min Operating Temperature: -55°C; Max Operating Temperature: 155°C; Packaging: Tape and Reel; Tolerance: 1%; Composition: Thick Film; Military Standard: Not; Length: 1.6mm; Height: 0.45mm; Width: 800um; Depth: 0.8mm; REACH SVHC: No SVHC; Lead Free: Lead Free; ComponentLink1URL: https://www.verical.com/server-webapp/html/getDatasheet?partID=409289&src-supplier=Verical; ComponentLink1Description: https://www.verical.com/server-webapp/html/getDatasheet?partID=409289&src-supplier=Verical
R31 R33 R37 R38 = R_0402: RES SMD 49.9 OHM 1% 1/10W 0603; Manufacturer: Yageo; Manufacturer Part Number: RC0603FR-0749R9L; Resistance: 49.9R; Power Rating: 100mW; Temperature Coefficient: 100ppm/°C; Voltage Rating (DC): 50V; ComponentLink1URL: http://documents.rs-components.com/techlib://itc_doclist_GB.htm?stockno=6184536&src-supplier=RSComponents; ComponentLink1Description: http://documents.rs-components.com/techlib://itc_doclist_GB.htm?stockno=6184536&src-supplier=RSComponents; ComponentLink2URL: http://www.farnell.com/datasheets/2167052.pdf?src-supplier=Element14; ComponentLink2Description: http://www.farnell.com/datasheets/2167052.pdf?src-supplier=Element14; ComponentLink3URL: http://www.yageo.com/documents/recent/PYu-RC0402_51_RoHS_L_6_r.pdf?src-supplier=Future+Electronics; ComponentLink3Description: http://www.yageo.com/documents/recent/PYu-RC0402_51_RoHS_L_6_r.pdf?src-supplier=Future+Electronics; ComponentLink4URL: http://www.farnell.com/datasheets/1018594.pdf?src-supplier=Element14; ComponentLink4Description: http://www.farnell.com/datasheets/1018594.pdf?src-supplier=Element14; ComponentLink5URL: http://www.yageo.com/documents/recent/PYu-RC_Group_51_RoHS_L_10.pdf?src-supplier=Digi-Key; ComponentLink5Description: http://www.yageo.com/documents/recent/PYu-RC_Group_51_RoHS_L_10.pdf?src-supplier=Digi-Key; Supplier 1: Digi-Key; Supplier Part Number 1: 311-49.9HRCT-ND; Stock 1: 9614882; Pricing 1: 1=0.1, 10=0.023, 100=0.0094, 1000=0.00421, 2500=0.00366 (USD); Case/Package: 0603; Number of Pins: 2; Case Code (Imperial): 0603; Case Code (Metric): 1608; Min Operating Temperature: -55°C; Max Operating Temperature: 155°C; Packaging: Tape and Reel; Tolerance: 1%; Military Standard: Not; Composition: Thick Film; Voltage Rating: 50V; Termination: SMD/SMT; Length: 1.6mm; Height: 0.45mm; Depth: 0.8mm; Lead Free: Lead Free; REACH SVHC: No SVHC; ComponentLink6URL: https://www.verical.com/server-webapp/html/getDatasheet?partID=325421&src-supplier=Verical; ComponentLink6Description: https://www.verical.com/server-webapp/html/getDatasheet?partID=325421&src-supplier=Verical; ComponentLink7URL: http://documents.rs-components.com/techlib://itc_doclist_GB.htm?stockno=5047565&src-supplier=RSComponents; ComponentLink7Description: http://documents.rs-components.com/techlib://itc_doclist_GB.htm?stockno=5047565&src-supplier=RSComponents
R39-R42 = R_0402: RES SMD 75 OHM 1% 1/10W 0603; Manufacturer: Yageo; Manufacturer Part Number: RC0603FR-0775RL; Resistance: 75R; Power Rating: 100mW; Voltage Rating: 50V; Temperature Coefficient: 100ppm/°C; Supplier 1: Digi-Key; Supplier Part Number 1: 311-75.0HRCT-ND; Stock 1: 9632228; Pricing 1: 1=0.1, 10=0.023, 100=0.0094, 1000=0.00421, 2500=0.00366 (USD); Case/Package: 0603; Case Code (Metric): 1608; Case Code (Imperial): 0603; Min Operating Temperature: -55°C; Max Operating Temperature: 155°C; Tolerance: 1%; Package Quantity: 1; Packaging: Tape and Reel; Composition: Thick Film; Number of Terminations: 2; Termination: SMD/SMT; Max Power Dissipation: 100mW; Voltage Rating (DC): 50V; Features: Moisture Resistant; Military Standard: Not; Length: 0.063inch; Height: 0.022inch; Width: 0.031inch; Depth: 0.8mm; Lead Free: Lead Free; REACH SVHC: No SVHC; ComponentLink1URL: http://www.yageo.com/documents/recent/PYu-RC_Group_51_RoHS_L_10.pdf?src-supplier=Digi-Key; ComponentLink1Description: http://www.yageo.com/documents/recent/PYu-RC_Group_51_RoHS_L_10.pdf?src-supplier=Digi-Key; ComponentLink2URL: http://www.farnell.com/datasheets/2167052.pdf?src-supplier=Element14; ComponentLink2Description: http://www.farnell.com/datasheets/2167052.pdf?src-supplier=Element14; ComponentLink3URL: http://documents.rs-components.com/techlib://itc_doclist_GB.htm?stockno=5048417&src-supplier=RSComponents; ComponentLink3Description: http://documents.rs-components.com/techlib://itc_doclist_GB.htm?stockno=5048417&src-supplier=RSComponents
SW1 = 219-3LPSTR: SWITCH SLIDE DIP SPST 100MA 20V; Manufacturer: CTS; Number of Positions: 3; Electrical Life: 2000Cycles; Actuator Type: Slide (Standard); Pitch: 0.1inch; Washable: Yes; Supplier 1: Digi-Key; Supplier Part Number 1: CT3115CT-ND; Manufacturer Part Number: 219-3LPSTR; Stock 1: 17768; Pricing 1: 1=0.82, 10=0.804, 25=0.758, 50=0.7116, 100=0.6806, 250=0.64964, 500=0.58776 (USD); Mount: Surface Mount; Contact Material: Copper; Contact Plating: Gold; Min Operating Temperature: -55°C; Max Operating Temperature: 85°C; Max Current Rating: 100mA; Packaging: Tape and Reel; Throw Configuration: SPST; Voltage Rating (DC): 20V; Package Quantity: 1000; Current Rating: 100mA; Termination: Gull Wing; Max Voltage Rating (DC): 20V; Orientation: Straight; Length: 0.358inch; Depth: 9.91mm; Radiation Hardening: No; Lead Free: Lead Free; ComponentLink1URL: https://www.verical.com/server-webapp/html/getDatasheet?partID=111650&src-supplier=Verical; ComponentLink1Description: https://www.verical.com/server-webapp/html/getDatasheet?partID=111650&src-supplier=Verical; ComponentLink2URL: http://www.ctscorp.com/CHN/components/Datasheets/219.pdf?src-supplier=Avnet; ComponentLink2Description: http://www.ctscorp.com/CHN/components/Datasheets/219.pdf?src-supplier=Avnet; ComponentLink3URL: http://www.ctscorp.com/components/Datasheets/219.pdf?src-supplier=Future+Electronics; ComponentLink3Description: http://www.ctscorp.com/components/Datasheets/219.pdf?src-supplier=Future+Electronics
U1 = ESP32-WROOM-32D: WIFI MODULE 64MBITS SPI FLASH; Manufacturer: Espressif Systems; Manufacturer Part Number: ESP32-WROOM-32U (8MB); Supplier 1: Digi-Key; Supplier Part Number 1: 1904-1027-1-ND
U2 = CP2104-F03-GMR: IC SGL USB-TO-UART BRIDGE 24QFN; Manufacturer: Silicon Labs; Number of Channels: 1; Max Supply Voltage: 3.6V; Min Supply Voltage: 3V; Operating Supply Voltage: 3.3V; Data Rate: 2Mbps; Number of I/Os: 4; Interface: UART; Operating Supply Current: 17mA; Supplier 1: Digi-Key; Supplier Part Number 1: 336-4146-1-ND; Manufacturer Part Number: CP2104-F03-GMR; Stock 1: 20376; Pricing 1: 1=1.65, 25=1.5864, 100=1.5836 (USD); Mount: Surface Mount; Case/Package: QFN EP; Number of Pins: 24; Weight: 0.001764oz; Contact Plating: Tin,Matte; Min Operating Temperature: -40°C; Max Operating Temperature: 85°C; Packaging: Tape and Reel; Package Quantity: 1500; Radiation Hardening: No; ComponentLink1URL: https://www.verical.com/server-webapp/html/getDatasheet?partID=711722&src-supplier=Verical; ComponentLink1Description: https://www.verical.com/server-webapp/html/getDatasheet?partID=711722&src-supplier=Verical; ComponentLink2URL: http://www.silabs.com/Support%20Documents/TechnicalDocs/CP2104-Short.pdf?src-supplier=Digi-Key; ComponentLink2Description: http://www.silabs.com/Support%20Documents/TechnicalDocs/CP2104-Short.pdf?src-supplier=Digi-Key; ComponentLink3URL: http://www.silabs.com/Support%20Documents/TechnicalDocs/cp2104.pdf?src-supplier=Avnet+Europe; ComponentLink3Description: http://www.silabs.com/Support%20Documents/TechnicalDocs/cp2104.pdf?src-supplier=Avnet+Europe
U3 = STM32F373VCT6: IC MCU 32BIT 256KB FLASH 100LQFP; Manufacturer: STMicroelectronics; Number of USB Channels: 1; Max Supply Voltage: 3.6V; Number of Timers/Counters: 14; Frequency: 72MHz; RAM Size: 32KB; Max Power Dissipation: 434mW; Interface: I2C,SPI,USB,CAN,IrDA,UART,USART,LIN,I2S; Number of I/Os: 84; Min Supply Voltage: 2V; Data Bus Width: 32b; Oscillator Type: Internal; Number of SPI Channels: 3; Number of I2C Channels: 2; Watchdog Timer: Yes; Peripherals: POR,PWM,WDT,DMA; Core Architecture: ARM; Supplier 1: Digi-Key; Supplier Part Number 1: 497-13234-ND; Manufacturer Part Number: STM32F373VCT6; Stock 1: 962; Pricing 1: 1=6.42, 90=5.53089, 180=4.80244, 540=4.18191, 1080=3.6423 (USD); Case/Package: LQFP; Number of Pins: 100; Contact Plating: Tin,Gold,Matte; Min Operating Temperature: -40°C; Max Operating Temperature: 85°C; Package Quantity: 90; Packaging: Tray; Number of Programmable I/O: 84; Max Frequency: 72MHz; Memory Type: FLASH; Memory Size: 256KB; Length: 14.2mm; Height: 1.45mm; Width: 14.2mm; Radiation Hardening: No; REACH SVHC: No SVHC; Lead Free: Lead Free; ComponentLink1URL: http://www.farnell.com/datasheets/1809253.pdf?src-supplier=Element14; ComponentLink1Description: http://www.farnell.com/datasheets/1809253.pdf?src-supplier=Element14; ComponentLink2URL: http://www.st.com/st-web-ui/static/active/en/resource/technical/document/datasheet/DM00046749.pdf?src-supplier=Future+Electronics; ComponentLink2Description: http://www.st.com/st-web-ui/static/active/en/resource/technical/document/datasheet/DM00046749.pdf?src-supplier=Future+Electronics; ComponentLink3URL: http://www.produktinfo.conrad.com/datenblaetter/1000000-1099999/001075618-da-01-en-MCU_32BT_256K_STM32F373VCT6_LQFP_100_STM.pdf?src-supplier=Conrad; ComponentLink3Description: http://www.produktinfo.conrad.com/datenblaetter/1000000-1099999/001075618-da-01-en-MCU_32BT_256K_STM32F373VCT6_LQFP_100_STM.pdf?src-supplier=Conrad
U4 = AP7361C-33FGE-7: IC REG LINEAR 3.3V 1A UDFN3030-8; Manufacturer: Diodes; Dropout Voltage: 360mV; Number of Regulators: 1; Min Current Limit: 1.1A; Supplier 1: Digi-Key; Supplier Part Number 1: AP7361C-33FGE-7DICT-ND; Manufacturer Part Number: AP7361C-33FGE-7; Stock 1: 11447; Pricing 1: 1=0.63, 10=0.541, 100=0.4038, 500=0.31724, 1000=0.24514 (USD); Mount: Surface Mount; Min Operating Temperature: -40°C; Max Operating Temperature: 85°C; Packaging: Tape and Reel; Output Voltage: 3.3V; Output Current: 1A
U5 U7 = NLAS4157DFT2G: IC SWITCH SPDT SC88; Manufacturer: ON Semiconductor; Manufacturer Part Number: NLAS4157DFT2G; Supplier 1: Digi-Key; Supplier Part Number 1: NLAS4157DFT2GOSCT-ND
U6 = MIC5504-3.3YM5-TR: IC REG LINEAR 3.3V 300MA SOT23-5; Manufacturer: Microchip Micrel; Min Input Voltage: 2.5V; Max Input Voltage: 5.5V; Dropout Voltage: 380mV; Number of Outputs: 1; Quiescent Current: 38uA; Accuracy: 3%; Operating Supply Current: 42uA; Power Supply Rejection Ratio (PSRR): 60dB; Output Type: Fixed; Supplier 1: Digi-Key; Supplier Part Number 1: 576-4764-1-ND; Manufacturer Part Number: MIC5504-3.3YM5-TR; Stock 1: 99045; Pricing 1: 1=0.11, 25=0.0928, 100=0.0824 (USD); Mount: Surface Mount; Case/Package: SOT-23-5; Number of Pins: 5; Min Operating Temperature: -40°C; Max Operating Temperature: 125°C; Nominal Output Voltage: 3.3V; Output Current: 300mA; Packaging: Tape and Reel; Output Voltage: 3.3V; Max Output Current: 300mA; Length: 2.9mm; Height: 1.1mm; Width: 1.6mm; REACH SVHC: No SVHC; ComponentLink1URL: http://www.farnell.com/datasheets/1856860.pdf?src-supplier=Element14; ComponentLink1Description: http://www.farnell.com/datasheets/1856860.pdf?src-supplier=Element14